# Altium project T_BIAS.PrjPcb
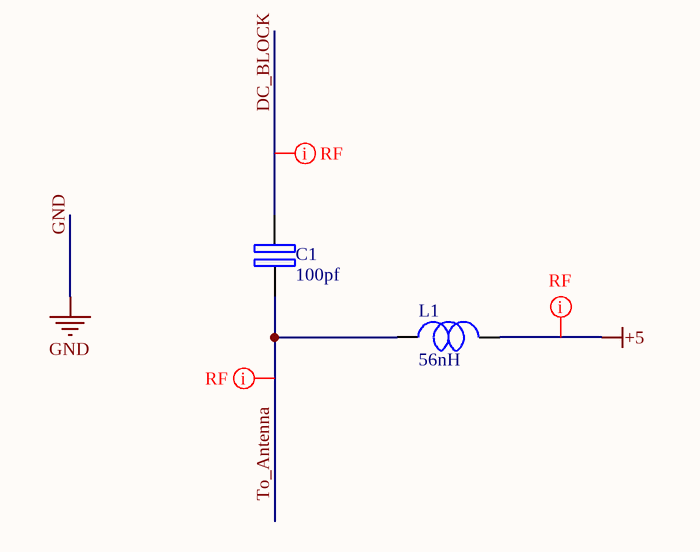
[diagram p0: T_BIAS.SchDoc]
1 sheet, 2 parts. Net scope: global (net labels, ports and power ports of the same name join across sheets).
Board file: T_BIAS.PcbDoc

## Sheet T_BIAS.SchDoc
size A; SheetNumber: 1; SheetTotal: 1

### Parts
C1  100pf  [CAPC0603X08L]
L1  56nH  [INDC0603X102-2L]

### Nets
+5: L1.2
DC_BLOCK: C1.2
To_Antenna: C1.1 L1.1

### Layout directives
net class RF: +5, DC_BLOCK, To_Antenna

### Library data of the parts
C1 = Capacitor2P-NP: The capacitor have 2PIN in AXIAL and SMD models. / all non-polar models include.; Created For: HiroNegarPars; Creator: Shahab Azmoodeh; Version: 1.0; Create Date: 2022/07/25; Must Assemble: *; PartNumber: *; Modified Date: 2022/07/25; Company: *; Value: 100pf
L1 = Inductor2P: generic smd and dip inductors; Created For: Hiro Negar; Creator: Milad Mohammadi Bidhandi; Version: 1.0; Create Date: 12.09.2022; Value: 56nH; Partnumber: *; Must Assemble: *; Modify Date: 13.09.2022; Company: *